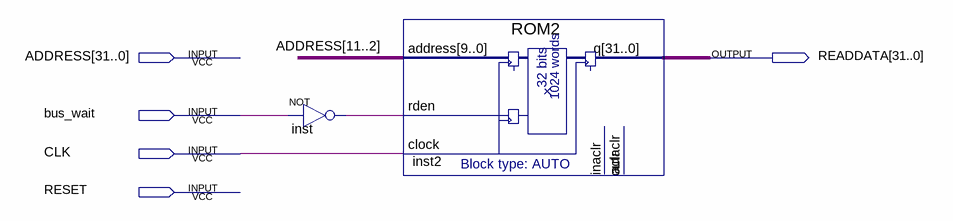
[diagram p0: schematic sheet]
// Quartus schematic InstructionMemory.bdf as structural Verilog: 2 symbols, 5 pins
module InstructionMemory (
  input  [31:0] ADDRESS,
  input  bus_wait,
  input  CLK,
  input  RESET,
  output [31:0] READDATA
);

  wire inst_out, undriven;

  not inst (inst_out, bus_wait);
  ROM2 inst2 (
    .address(ADDRESS[11:2]), .rden(inst_out), .clock(CLK), .aclr(undriven), .outaclr(undriven), .q(READDATA));  // open: inaclr
endmodule
